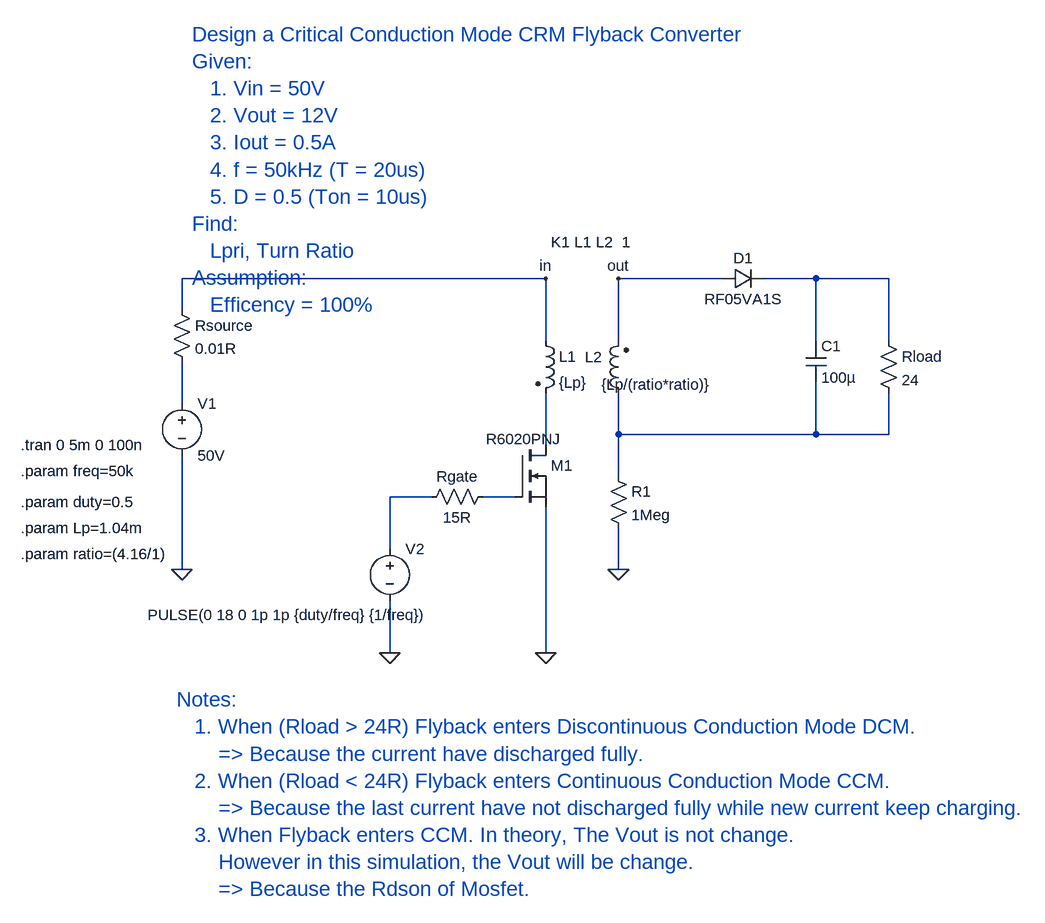
[diagram p0: schematic Design a CRM Flyback Converter.asc]
Design a CRM Flyback Converter.asc, the LTspice schematic file:
Version 4
SHEET 1 2204 828
WIRE 544 -96 -16 -96
WIRE 816 -96 656 -96
WIRE 960 -96 880 -96
WIRE 1072 -96 960 -96
WIRE -16 -48 -16 -96
WIRE 544 0 544 -96
WIRE 656 0 656 -96
WIRE 960 0 960 -96
WIRE 1072 0 1072 -96
WIRE -16 96 -16 32
WIRE 656 144 656 80
WIRE 960 144 960 64
WIRE 960 144 656 144
WIRE 1072 144 1072 80
WIRE 1072 144 960 144
WIRE 544 160 544 80
WIRE 656 208 656 144
WIRE 368 240 304 240
WIRE 496 240 448 240
WIRE 304 320 304 240
WIRE -16 352 -16 176
WIRE 656 352 656 288
WIRE 304 480 304 400
WIRE 544 480 544 256
FLAG 544 480 0
FLAG -16 352 0
FLAG 304 480 0
FLAG 656 352 0
FLAG 656 -96 out
FLAG 544 -96 in
SYMBOL voltage -16 80 R0
WINDOW 123 0 0 Left 0
WINDOW 39 0 0 Left 0
SYMATTR InstName V1
SYMATTR Value 50V
SYMBOL ind2 528 -16 R0
SYMATTR InstName L1
SYMATTR Value {Lp}
SYMATTR Type ind
SYMBOL ind2 672 96 R180
WINDOW 0 41 71 Left 2
WINDOW 3 -128 29 Left 2
SYMATTR InstName L2
SYMATTR Value {Lp/(ratio*ratio)}
SYMATTR Type ind
SYMBOL nmos 496 160 R0
WINDOW 3 -44 -9 Left 2
SYMATTR Value R6020PNJ
SYMATTR InstName M1
SYMBOL voltage 304 304 R0
WINDOW 123 0 0 Left 0
WINDOW 39 0 0 Left 0
WINDOW 3 -373 118 Left 2
SYMATTR Value PULSE(0 18 0 1p 1p {duty/freq} {1/freq})
SYMATTR InstName V2
SYMBOL res 464 224 R90
WINDOW 0 0 56 VBottom 2
WINDOW 3 32 56 VTop 2
SYMATTR InstName Rgate
SYMATTR Value 15R
SYMBOL res -32 -64 R0
SYMATTR InstName Rsource
SYMATTR Value 0.01R
SYMBOL res 1056 -16 R0
SYMATTR InstName Rload
SYMATTR Value 24
SYMBOL res 640 192 R0
SYMATTR InstName R1
SYMATTR Value 1Meg
SYMBOL diode 816 -80 R270
WINDOW 0 32 32 VTop 2
WINDOW 3 0 32 VBottom 2
SYMATTR InstName D1
SYMATTR Value RF05VA1S
SYMBOL cap 944 0 R0
SYMATTR InstName C1
SYMATTR Value 100µ
TEXT 552 -152 Left 2 !K1 L1 L2  1
TEXT -264 160 Left 2 !.tran 0 5m 0 100n
TEXT -264 200 Left 2 !.param freq=50k
TEXT -264 248 Left 2 !.param duty=0.5
TEXT -264 288 Left 2 !.param Lp=1.04m
TEXT -264 328 Left 2 !.param ratio=(4.16/1)
TEXT 0 -472 Left 3 ;Design a Critical Conduction Mode CRM Flyback Converter\nGiven:\n   1. Vin = 50V\n   2. Vout = 12V\n   3. Iout = 0.5A\n   4. f = 50kHz (T = 20us)\n   5. D = 0.5 (Ton = 10us)\nFind:\n   Lpri, Turn Ratio\nAssumption:\n   Efficency = 100%
TEXT -24 552 Left 3 ;Notes:\n   1. When (Rload > 24R) Flyback enters Discontinuous Conduction Mode DCM.\n       => Because the current have discharged fully.\n   2. When (Rload < 24R) Flyback enters Continuous Conduction Mode CCM.\n       => Because the last current have not discharged fully while new current keep charging.\n   3. When Flyback enters CCM. In theory, The Vout is not change.\n       However in this simulation, the Vout will be change.\n       => Because the Rdson of Mosfet.

The netlist it stands for:
* Design a CRM Flyback Converter.asc
V1 N002 0 50V
L1 in N004 {Lp}
L2 N003 out {Lp/(ratio*ratio)}
M1 N004 N006 0 0 R6020PNJ
V2 N005 0 PULSE(0 18 0 1p 1p {duty/freq} {1/freq})
Rgate N006 N005 15R
Rsource in N002 0.01R
Rload N001 N003 24
R1 N003 0 1Meg
D1 out N001 RF05VA1S
C1 N001 N003 100µ
.model D D
.lib standard.dio
.model NMOS NMOS
.model PMOS PMOS
.lib standard.mos
K1 L1 L2  1
.tran 0 5m 0 100n
.param freq=50k
.param duty=0.5
.param Lp=1.04m
.param ratio=(4.16/1)
* Design a Critical Conduction Mode CRM Flyback Converter
* Given:
*    1. Vin = 50V
*    2. Vout = 12V
*    3. Iout = 0.5A
*    4. f = 50kHz (T = 20us)
*    5. D = 0.5 (Ton = 10us)
* Find:
*    Lpri, Turn Ratio
* Assumption:
*    Efficency = 100%
* Notes:
*    1. When (Rload > 24R) Flyback enters Discontinuous Conduction Mode DCM.
*        => Because the current have discharged fully.
*    2. When (Rload < 24R) Flyback enters Continuous Conduction Mode CCM.
*        => Because the last current have not discharged fully while new current keep charging.
*    3. When Flyback enters CCM. In theory, The Vout is not change.
*        However in this simulation, the Vout will be change.
*        => Because the Rdson of Mosfet.
.backanno
.end